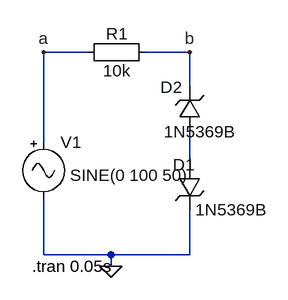
[diagram p0: schematic limiter_zener_two_sided_serial.asc]
limiter_zener_two_sided_serial.asc, the LTspice schematic file:
Version 4
SHEET 1 880 680
WIRE 16 48 -48 48
WIRE 160 48 96 48
WIRE 160 96 160 48
WIRE -48 176 -48 48
WIRE 160 208 160 160
WIRE -48 336 -48 256
WIRE 48 336 -48 336
WIRE 160 336 160 272
WIRE 160 336 48 336
WIRE 48 352 48 336
FLAG -48 48 a
FLAG 160 48 b
FLAG 48 352 0
SYMBOL zener 144 208 R0
WINDOW 0 -8 0 Left 2
SYMATTR InstName D1
SYMATTR Value 1N5369B
SYMATTR Description Diode
SYMATTR Type diode
SYMBOL Misc\\signal -48 160 R0
WINDOW 123 0 0 Left 2
WINDOW 39 0 0 Left 2
WINDOW 3 38 63 Left 2
SYMATTR Value SINE(0 100 50)
SYMATTR InstName V1
SYMBOL Misc\\EuropeanResistor 112 32 R90
WINDOW 0 5 56 VBottom 2
WINDOW 3 27 56 VTop 2
SYMATTR InstName R1
SYMATTR Value 10k
SYMBOL zener 176 160 R180
WINDOW 0 27 62 Left 2
WINDOW 3 -48 -1 Left 2
SYMATTR InstName D2
SYMATTR Value 1N5369B
SYMATTR Description Diode
SYMATTR Type diode
TEXT -64 352 Left 2 !.tran 0.05s

The netlist it stands for:
* limiter_zener_two_sided_serial.asc
D1 N001 0 1N5369B
V1 a 0 SINE(0 100 50)
R1 b a 10k
D2 N001 b 1N5369B
.model D D
.lib standard.dio
.tran 0.05s
.backanno
.end